# Altium schematic sheet Gateway.SchDoc
size A
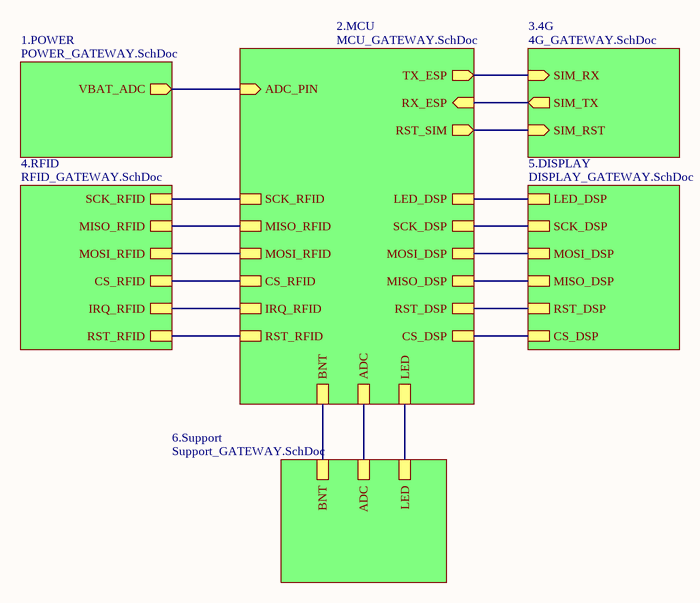
[diagram p0: Gateway.SchDoc]

## Sub-sheets
1.POWER = POWER_GATEWAY.SchDoc: VBAT_ADC (out)
2.MCU = MCU_GATEWAY.SchDoc: ADC_PIN (in), TX_ESP (out), RX_ESP (in), RST_SIM (out), LED_DSP, SCK_DSP, MOSI_DSP, MISO_DSP, RST_DSP, CS_DSP, SCK_RFID, MISO_RFID, MOSI_RFID, CS_RFID, IRQ_RFID, RST_RFID, BNT, ADC, LED
3.4G = 4G_GATEWAY.SchDoc: SIM_RX (in), SIM_TX (out), SIM_RST (in)
4.RFID = RFID_GATEWAY.SchDoc: SCK_RFID, MISO_RFID, MOSI_RFID, CS_RFID, IRQ_RFID, RST_RFID
5.DISPLAY = DISPLAY_GATEWAY.SchDoc: LED_DSP, SCK_DSP, MOSI_DSP, MISO_DSP, RST_DSP, CS_DSP
6.Support = Support_GATEWAY.SchDoc: BNT, ADC, LED

## Nets
(unnamed): sheet 1.POWER/VBAT_ADC, sheet 2.MCU/ADC_PIN
(unnamed): sheet 2.MCU/TX_ESP, sheet 3.4G/SIM_RX
(unnamed): sheet 2.MCU/RX_ESP, sheet 3.4G/SIM_TX
(unnamed): sheet 2.MCU/RST_SIM, sheet 3.4G/SIM_RST
(unnamed): sheet 2.MCU/LED_DSP, sheet 5.DISPLAY/LED_DSP
(unnamed): sheet 2.MCU/SCK_DSP, sheet 5.DISPLAY/SCK_DSP
(unnamed): sheet 2.MCU/MOSI_DSP, sheet 5.DISPLAY/MOSI_DSP
(unnamed): sheet 2.MCU/MISO_DSP, sheet 5.DISPLAY/MISO_DSP
(unnamed): sheet 2.MCU/RST_DSP, sheet 5.DISPLAY/RST_DSP
(unnamed): sheet 2.MCU/CS_DSP, sheet 5.DISPLAY/CS_DSP
(unnamed): sheet 2.MCU/SCK_RFID, sheet 4.RFID/SCK_RFID
(unnamed): sheet 2.MCU/MISO_RFID, sheet 4.RFID/MISO_RFID
(unnamed): sheet 2.MCU/MOSI_RFID, sheet 4.RFID/MOSI_RFID
(unnamed): sheet 2.MCU/CS_RFID, sheet 4.RFID/CS_RFID
(unnamed): sheet 2.MCU/IRQ_RFID, sheet 4.RFID/IRQ_RFID
(unnamed): sheet 2.MCU/RST_RFID, sheet 4.RFID/RST_RFID
(unnamed): sheet 2.MCU/BNT, sheet 6.Support/BNT
(unnamed): sheet 2.MCU/ADC, sheet 6.Support/ADC
(unnamed): sheet 2.MCU/LED, sheet 6.Support/LED